# Altium schematic sheet Sheet.SchDoc
size A; SheetNumber: 1; SheetTotal: 4
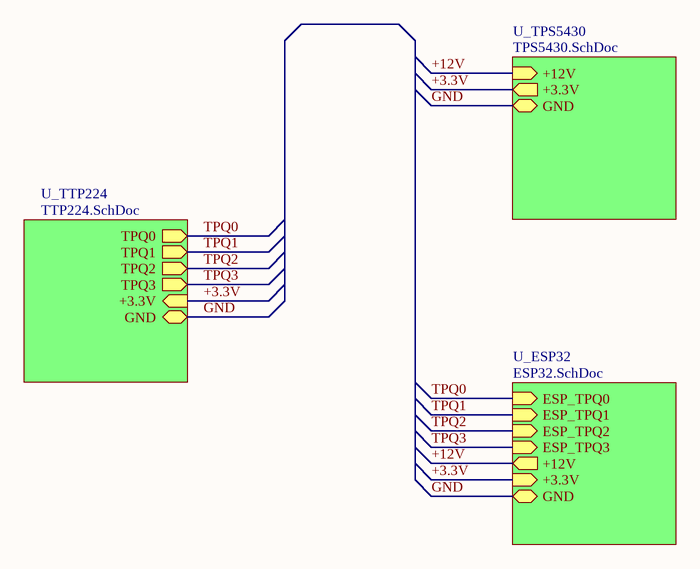
[diagram p0: Sheet.SchDoc]

## Sub-sheets
U_ESP32 = ESP32.SchDoc: ESP_TPQ0 (in), ESP_TPQ1 (in), ESP_TPQ2 (in), ESP_TPQ3 (in), +3.3V (in), GND (bidir), +12V (out)
U_TPS5430 = TPS5430.SchDoc: +12V (in), +3.3V (out), GND (bidir)
U_TTP224 = TTP224.SchDoc: TPQ0 (out), TPQ1 (out), TPQ2 (out), TPQ3 (out), +3.3V (in), GND (bidir)

## Nets
+3.3V: sheet U_ESP32/+3.3V, sheet U_TPS5430/+3.3V, sheet U_TTP224/+3.3V
+12V: sheet U_ESP32/+12V, sheet U_TPS5430/+12V
GND: sheet U_ESP32/GND, sheet U_TPS5430/GND, sheet U_TTP224/GND
TPQ0: sheet U_ESP32/ESP_TPQ0, sheet U_TTP224/TPQ0
TPQ1: sheet U_ESP32/ESP_TPQ1, sheet U_TTP224/TPQ1
TPQ2: sheet U_ESP32/ESP_TPQ2, sheet U_TTP224/TPQ2
TPQ3: sheet U_ESP32/ESP_TPQ3, sheet U_TTP224/TPQ3